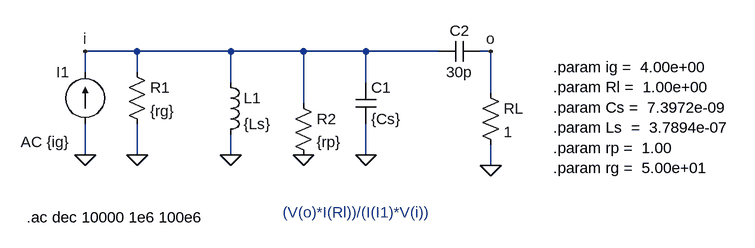
[diagram p0: schematic adaptadorL_ant_alternativas.asc]
adaptadorL_ant_alternativas.asc, the LTspice schematic file:
Version 4
SHEET 1 880 680
WIRE -80 32 -160 32
WIRE 64 32 -80 32
WIRE 176 32 64 32
WIRE 272 32 176 32
WIRE 384 32 272 32
WIRE 464 32 448 32
WIRE -160 64 -160 32
WIRE -80 64 -80 32
WIRE 64 80 64 32
WIRE 272 80 272 32
WIRE 464 96 464 32
WIRE 176 112 176 32
WIRE -160 192 -160 144
WIRE -80 192 -80 144
WIRE 64 192 64 160
WIRE 272 192 272 144
WIRE 464 208 464 176
FLAG 176 192 0
FLAG 272 192 0
FLAG -80 192 0
FLAG -160 192 0
FLAG 64 192 0
FLAG 464 208 0
FLAG 464 32 o
FLAG -160 32 i
SYMBOL current -160 144 R180
WINDOW 0 24 80 Left 2
WINDOW 3 24 0 Left 2
WINDOW 123 24 -28 Left 2
WINDOW 39 0 0 Left 0
SYMATTR InstName I1
SYMATTR Value ""
SYMATTR Value2 AC {ig}
SYMBOL res -96 48 R0
SYMATTR InstName R1
SYMATTR Value {rg}
SYMBOL cap 256 80 R0
SYMATTR InstName C1
SYMATTR Value {Cs}
SYMATTR SpiceLine Rser=0
SYMBOL res 160 96 R0
SYMATTR InstName R2
SYMATTR Value {rp}
SYMBOL ind 48 64 R0
SYMATTR InstName L1
SYMATTR Value {Ls}
SYMBOL res 448 80 R0
SYMATTR InstName RL
SYMATTR Value 1
SYMBOL cap 448 16 R90
WINDOW 0 0 32 VBottom 2
WINDOW 3 32 32 VTop 2
SYMATTR InstName C2
SYMATTR Value 30p
TEXT -250 288 Left 2 !.ac dec 10000 1e6 100e6
TEXT 560 56 Left 2 !.param ig =  4.00e+00 \n.param Rl =  1.00e+00 \n.param Cs =  7.3972e-09 \n.param Ls  =  3.7894e-07 \n.param rp =  1.00 \n.param rg =  5.00e+01
TEXT 144 280 Left 2 ;(V(o)*I(Rl))/(I(I1)*V(i))

The netlist it stands for:
* adaptadorL_ant_alternativas.asc
I1 0 i AC {ig}
R1 i 0 {rg}
C1 i 0 {Cs} Rser=0
R2 i 0 {rp}
L1 i 0 {Ls}
RL o 0 1
C2 o i 30p
.ac dec 10000 1e6 100e6
.param ig =  4.00e+00
.param Rl =  1.00e+00
.param Cs =  7.3972e-09
.param Ls  =  3.7894e-07
.param rp =  1.00
.param rg =  5.00e+01
* (V(o)*I(Rl))/(I(I1)*V(i))
.backanno
.end